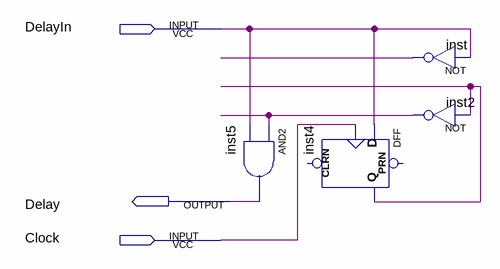
[diagram p0: schematic sheet]
// Quartus schematic DelayOut.bdf as structural Verilog: 4 symbols, 3 pins
module DelayOut (
  input  DelayIn,
  input  Clock,
  output Delay
);

  wire inst2_out, inst4_q, inst_out;

  and inst5 (Delay, inst2_out, DelayIn);
  DFF inst4 (.CLK(Clock), .D(DelayIn), .Q(inst4_q));  // open: CLRN, PRN
  not inst (inst_out, DelayIn);
  not inst2 (inst2_out, inst4_q);
endmodule
